# Altium schematic sheet WV240-E-D001-MC Rev.1.0.SchDoc
size A3; DocumentNumber: 1; Revision: V1.0; SheetNumber: 1; SheetTotal: 9; Rule: PcbType=ProtelPcb
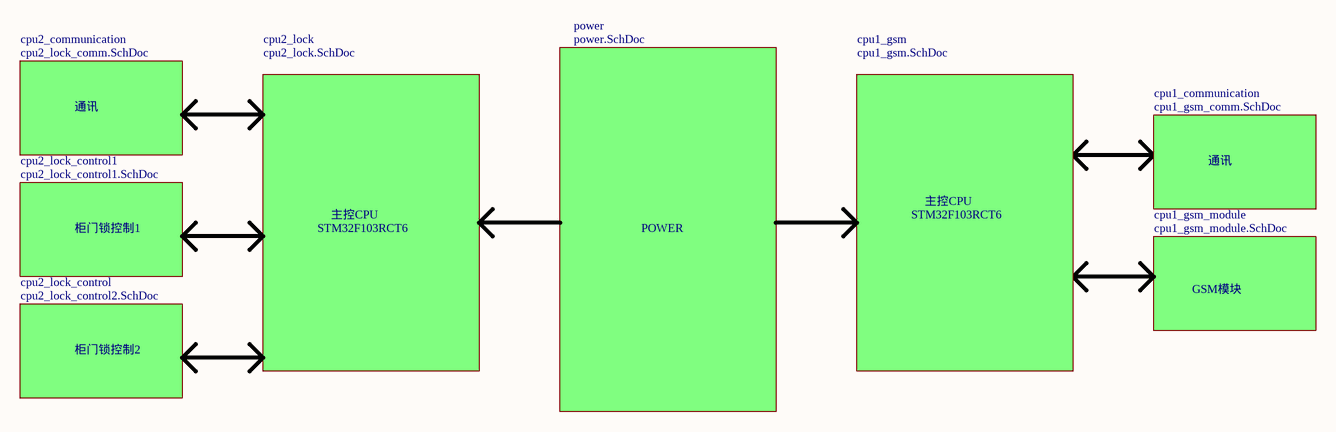
[diagram p0: WV240-E-D001-MC Rev.1.0.SchDoc]

## Sub-sheets
cpu1_communication = cpu1_gsm_comm.SchDoc: no entries
cpu1_gsm = cpu1_gsm.SchDoc: no entries
cpu1_gsm_module = cpu1_gsm_module.SchDoc: no entries
cpu2_communication = cpu2_lock_comm.SchDoc: no entries
cpu2_lock = cpu2_lock.SchDoc: no entries
cpu2_lock_control = cpu2_lock_control2.SchDoc: no entries
cpu2_lock_control1 = cpu2_lock_control1.SchDoc: no entries
power = power.SchDoc: no entries

## Notes on the sheet
- 通讯
- 主控CPU
- 柜门锁控制1
- STM32F103RCT6
- POWER
- GSM模块
- 柜门锁控制2
- :